# Altium project Controller-Board.PrjPcb
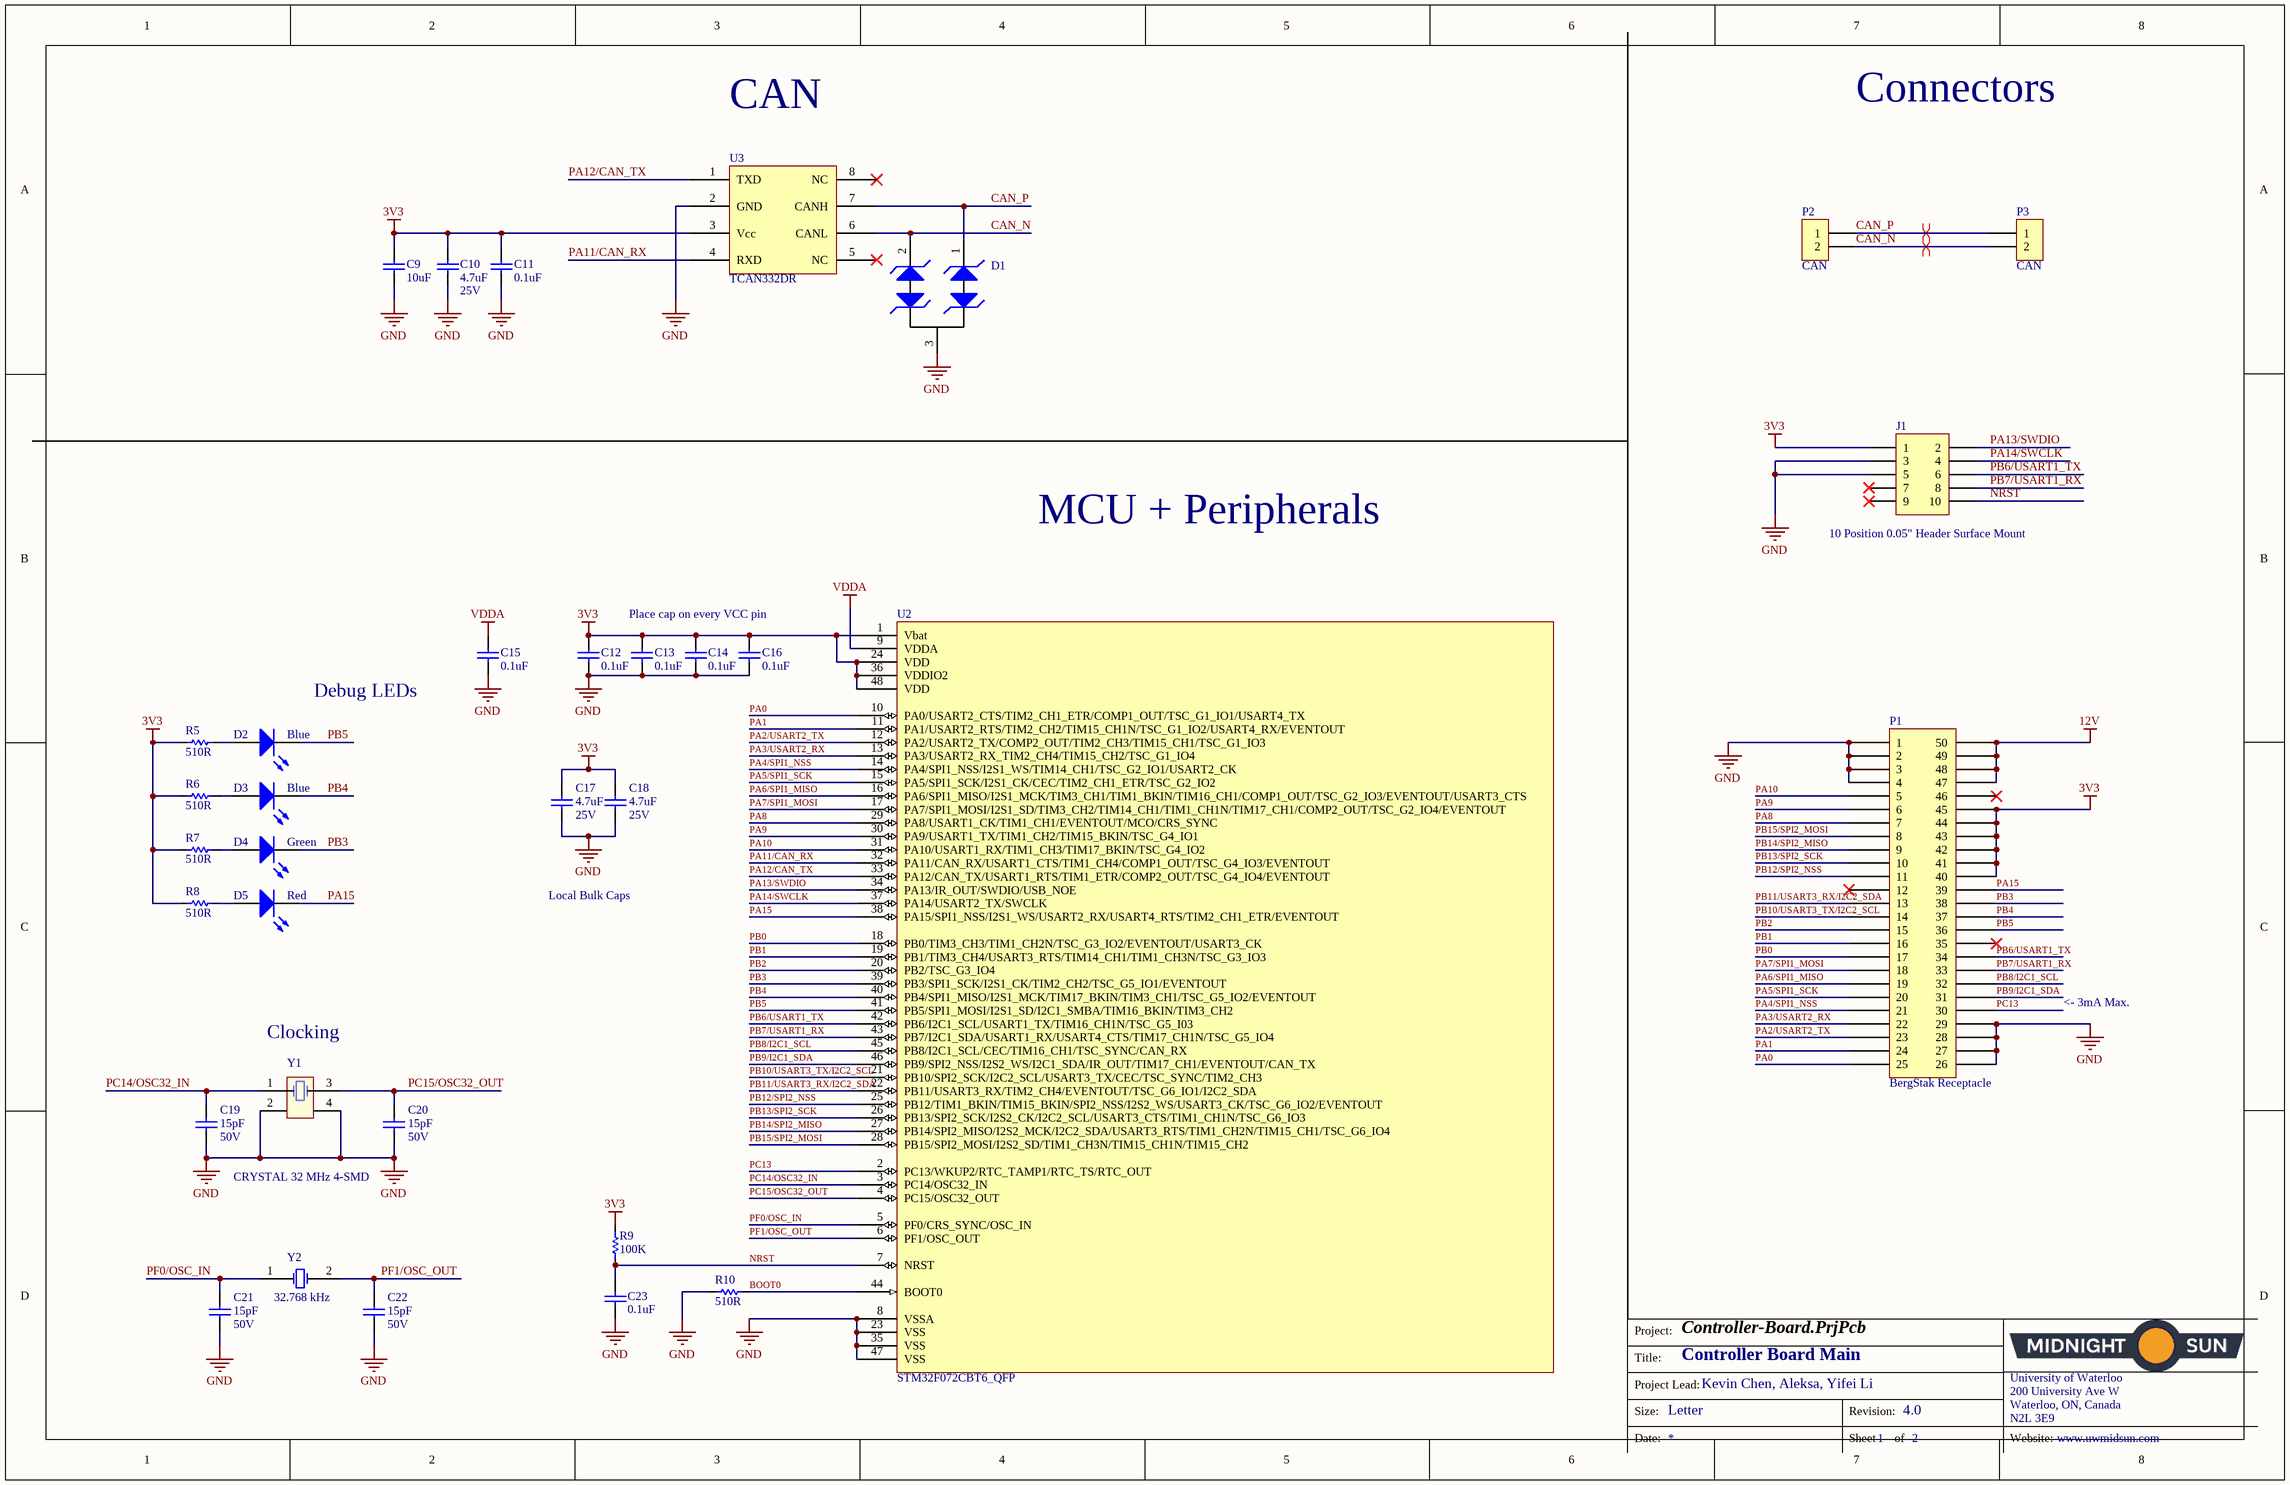
[diagram p0: Controller_Board_Main.SchDoc]
2 sheets, 56 parts. Net scope: global (net labels, ports and power ports of the same name join across sheets).
Board files: Controller-Board-Rev3.PcbDoc, Controller-Board-Rev3-Panelized.PcbDoc
Sheets:
  Controller_Board_Main.SchDoc
  Controller_Board_Power_Supply.SchDoc

## Sheet Controller_Board_Main.SchDoc: Controller Board Main
size Tabloid; Author: Kevin Chen, Aleksa, Yifei Li; DrawnBy: Kevin Chen, Yifei Li; Engineer: Kevin Chen, Yifei Li; Revision: 4.0; SheetNumber: 1; SheetTotal: 2; PageSetup: Record=PageOptions|CenterHorizontal=True|CenterVertical=True|PrintScale=0.64|XCorrection=1.00|YCorrection=1.00|PrintKind=1|BorderSize=5000000|LeftOffset=0|BottomOffset=0|Orientation=2|PaperLength=1000|PaperWidth=1000|Scale=100|PaperSource=7|PrintQuality=-3|MediaType=1|DitherType=10|PrintScaleMode=1|PaperKind=Letter|PaperIndex=1; Website: www.uwmidsun.com

### Parts
C9  10uF  [CAPC1608X06N]
C10  4.7uF  Voltage: 25V  [CAPC1608X06N]
C11  0.1uF  [CAPC1608X06N]
C12  0.1uF  [CAPC1608X06N]
C13  0.1uF  [CAPC1608X06N]
C14  0.1uF  [CAPC1608X06N]
C15  0.1uF  [CAP, 0603]
C16  0.1uF  [CAPC1608X06N]
C17  4.7uF  Voltage: 25V  [CAPC1608X06N]
C18  4.7uF  Voltage: 25V  [CAPC1608X06N]
C19  15pF  Voltage: 50V  [CAPC1608X06N]
C20  15pF  Voltage: 50V  [CAPC1608X06N]
C21  15pF  Voltage: 50V  [CAPC1608X06N]
C22  15pF  Voltage: 50V  [CAPC1608X06N]
C23  0.1uF  [CAPC1608X06N]
D1  TVS Diode  [SOT23]  (value not drawn)
D2  Blue  [DIOC1608X06N]
D3  Blue  [DIOC1608X06N]
D4  Green  [DIOC1608X06N]
D5  Red  [DIOC1608X06N]
J1  10 Position 0.05" Header Surface Mount  [10 POS 1.27MM RECT CONN]
P1  BergStak Receptacle  [Bergstak 50 Pos Receptacle]
P2  CAN  [2 POS Dura-Click]
P3  CAN  [2 POS Dura-Click]
R5  510R  [RESC1608X06N]
R6  510R  [RESC1608X06N]
R7  510R  [RESC1608X06N]
R8  510R  [RESC1608X06N]
R9  100K  [RESC1608X06N]
R10  510R  [RESC1608X06N]
U2  STM32F072CBT6_QFP  [TSQFP50P890X890X160-48M]
U3  Manufacturer Part Number: TCAN332DR  [TSOP65P280X145-8N]  (hidden comment: TCAN332DR CAN Transceiver_SOT)
Y1  CRYSTAL 32 MHz 4-SMD  [CX2520DB CRYSTAL]
Y2  32.768 kHz  [ABS07AIG CRYSTAL]

### Nets
3V3: C9.2 C10.2 C11.2 C12.2 C13.2 C14.2 C16.2 C17.2 C18.2 J1.1 P1.40 P1.41 P1.42 P1.43 P1.44 P1.45 R5.1 R6.1 R7.1 R8.1 R9.2 U2.1(Vbat) U2.24(VDD) U2.36(VDDIO2) U2.48(VDD) U3.3(Vcc)
12V: P1.47 P1.48 P1.49 P1.50
GND: C9.1 C10.1 C11.1 C12.1 C13.1 C14.1 C15.1 C16.1 C17.1 C18.1 C19.1 C20.1 C21.1 C22.1 C23.1 D1.3(Common_Cathode) J1.3 J1.5 P1.1 P1.2 P1.3 P1.4 P1.26 P1.27 P1.28 P1.29 R10.1 U2.8(VSSA) U2.23(VSS) U2.35(VSS) U2.47(VSS) U3.2(GND) Y1.2 Y1.4
VDDA: C15.2 U2.9(VDDA)
BOOT0: R10.2 U2.44(BOOT0)
CAN_N: D1.2(Cathode2) P2.2 P3.2 U3.6(CANL)
CAN_P: D1.1(Cathode1) P2.1 P3.1 U3.7(CANH)
NRST: C23.2 J1.10 R9.1 U2.7(NRST)
PA0: P1.25 U2.10(PA0/USART2_CTS/TIM2_CH1_ETR/COMP1_OUT/TSC_G1_IO1/USART4_TX)
PA1: P1.24 U2.11(PA1/USART2_RTS/TIM2_CH2/TIM15_CH1N/TSC_G1_IO2/USART4_RX/EVENTOUT)
PA2/USART2_TX: P1.23 U2.12(PA2/USART2_TX/COMP2_OUT/TIM2_CH3/TIM15_CH1/TSC_G1_IO3)
PA3/USART2_RX: P1.22 U2.13(PA3/USART2_RX_TIM2_CH4/TIM15_CH2/TSC_G1_IO4)
PA4/SPI1_NSS: P1.21 U2.14(PA4/SPI1_NSS/I2S1_WS/TIM14_CH1/TSC_G2_IO1/USART2_CK)
PA5/SPI1_SCK: P1.20 U2.15(PA5/SPI1_SCK/I2S1_CK/CEC/TIM2_CH1_ETR/TSC_G2_IO2)
PA6/SPI1_MISO: P1.19 U2.16(PA6/SPI1_MISO/I2S1_MCK/TIM3_CH1/TIM1_BKIN/TIM16_CH1/COMP1_OUT/TSC_G2_IO3/EVENTOUT/USART3_CTS)
PA7/SPI1_MOSI: P1.18 U2.17(PA7/SPI1_MOSI/I2S1_SD/TIM3_CH2/TIM14_CH1/TIM1_CH1N/TIM17_CH1/COMP2_OUT/TSC_G2_IO4/EVENTOUT)
PA8: P1.7 U2.29(PA8/USART1_CK/TIM1_CH1/EVENTOUT/MCO/CRS_SYNC)
PA9: P1.6 U2.30(PA9/USART1_TX/TIM1_CH2/TIM15_BKIN/TSC_G4_IO1)
PA10: P1.5 U2.31(PA10/USART1_RX/TIM1_CH3/TIM17_BKIN/TSC_G4_IO2)
PA11/CAN_RX: U2.32(PA11/CAN_RX/USART1_CTS/TIM1_CH4/COMP1_OUT/TSC_G4_IO3/EVENTOUT) U3.4(RXD)
PA12/CAN_TX: U2.33(PA12/CAN_TX/USART1_RTS/TIM1_ETR/COMP2_OUT/TSC_G4_IO4/EVENTOUT) U3.1(TXD)
PA13/SWDIO: J1.2 U2.34(PA13/IR_OUT/SWDIO/USB_NOE)
PA14/SWCLK: J1.4 U2.37(PA14/USART2_TX/SWCLK)
PA15: D5.2(K) P1.39 U2.38(PA15/SPI1_NSS/I2S1_WS/USART2_RX/USART4_RTS/TIM2_CH1_ETR/EVENTOUT)
PB0: P1.17 U2.18(PB0/TIM3_CH3/TIM1_CH2N/TSC_G3_IO2/EVENTOUT/USART3_CK)
PB1: P1.16 U2.19(PB1/TIM3_CH4/USART3_RTS/TIM14_CH1/TIM1_CH3N/TSC_G3_IO3)
PB2: P1.15 U2.20(PB2/TSC_G3_IO4)
PB3: D4.2(K) P1.38 U2.39(PB3/SPI1_SCK/I2S1_CK/TIM2_CH2/TSC_G5_IO1/EVENTOUT)
PB4: D3.2(K) P1.37 U2.40(PB4/SPI1_MISO/I2S1_MCK/TIM17_BKIN/TIM3_CH1/TSC_G5_IO2/EVENTOUT)
PB5: D2.2(K) P1.36 U2.41(PB5/SPI1_MOSI/I2S1_SD/I2C1_SMBA/TIM16_BKIN/TIM3_CH2)
PB6/USART1_TX: J1.6 P1.34 U2.42(PB6/I2C1_SCL/USART1_TX/TIM16_CH1N/TSC_G5_I03)
PB7/USART1_RX: J1.8 P1.33 U2.43(PB7/I2C1_SDA/USART1_RX/USART4_CTS/TIM17_CH1N/TSC_G5_IO4)
PB8/I2C1_SCL: P1.32 U2.45(PB8/I2C1_SCL/CEC/TIM16_CH1/TSC_SYNC/CAN_RX)
PB9/I2C1_SDA: P1.31 U2.46(PB9/SPI2_NSS/I2S2_WS/I2C1_SDA/IR_OUT/TIM17_CH1/EVENTOUT/CAN_TX)
PB10/USART3_TX/I2C2_SCL: P1.14 U2.21(PB10/SPI2_SCK/I2C2_SCL/USART3_TX/CEC/TSC_SYNC/TIM2_CH3)
PB11/USART3_RX/I2C2_SDA: P1.13 U2.22(PB11/USART3_RX/TIM2_CH4/EVENTOUT/TSC_G6_IO1/I2C2_SDA)
PB12/SPI2_NSS: P1.11 U2.25(PB12/TIM1_BKIN/TIM15_BKIN/SPI2_NSS/I2S2_WS/USART3_CK/TSC_G6_IO2/EVENTOUT)
PB13/SPI2_SCK: P1.10 U2.26(PB13/SPI2_SCK/I2S2_CK/I2C2_SCL/USART3_CTS/TIM1_CH1N/TSC_G6_IO3)
PB14/SPI2_MISO: P1.9 U2.27(PB14/SPI2_MISO/I2S2_MCK/I2C2_SDA/USART3_RTS/TIM1_CH2N/TIM15_CH1/TSC_G6_IO4)
PB15/SPI2_MOSI: P1.8 U2.28(PB15/SPI2_MOSI/I2S2_SD/TIM1_CH3N/TIM15_CH1N/TIM15_CH2)
PC13: P1.30 U2.2(PC13/WKUP2/RTC_TAMP1/RTC_TS/RTC_OUT)
PC14/OSC32_IN: C19.2 U2.3(PC14/OSC32_IN) Y1.1(OSC1)
PC15/OSC32_OUT: C20.2 U2.4(PC15/OSC32_OUT) Y1.3(OSC2)
PF0/OSC_IN: C21.2 U2.5(PF0/CRS_SYNC/OSC_IN) Y2.1
PF1/OSC_OUT: C22.2 U2.6(PF1/OSC_OUT) Y2.2
NetD2_1: D2.1(A) R5.2
NetD3_1: D3.1(A) R6.2
NetD4_1: D4.1(A) R7.2
NetD5_1: D5.1(A) R8.2

Not connected (* = marked no-connect by the designer): J1 7* 9*; P1 12* 35* 46*; U3 5(NC)* 8(NC)*

### Layout directives
differential pair: CAN_N, CAN_P

### Notes on the sheet
- CAN
- Connectors
- MCU + Peripherals
- Place cap on every VCC pin
- Debug LEDs
- Local Bulk Caps
- <- 3mA Max.
- (near Y1) Clocking
- Project:
- Title:
- Size:
- Project Lead:
- Letter
- Revision:
- University of Waterloo
- 200 University Ave W
- Waterloo, ON, Canada
- N2L 3E9
- Date:
- Sheet
- of
- Website:

### Library data of the parts
C9 = CAP CER 10uF 25V 20% X5R 0603: 10µF ±20% 25V Ceramic Capacitor X5R 0603 (1608 Metric); Manufacturer: Murata Electronics North America; ManufacturerPartNumber: GRM188R61E106MA73D; Value: 10uF; Supplier: Digi-Key; SupplierPartNumber: 490-7202-1-ND; Voltage: 25V
C10 C17 C18 = CAP CER 4.7UF 25V 10% X5R 0603: 4.7µF ±10% 25V Ceramic Capacitor X5R 0603 (1608 Metric); Manufacturer: Murata Electronics North America; ManufacturerPartNumber: GRM188R61E475KE11D; Value: 4.7uF; Supplier: Digi-Key; SupplierPartNumber: 490-7203-1-ND
C11-C16 C23 = CAP CER 0.1UF 50V 10% X7R 0603: 0.10µF ±10% 50V Ceramic Capacitor X7R 0603 (1608 Metric); Manufacturer: AVX Corporation; ManufacturerPartNumber: 06035C104KAT2A; Value: 0.1uF; Supplier: Digi-Key; SupplierPartNumber: 478-5052-1-ND; Voltage: 50V
C19-C22 = CAP CER 15PF 50V NPO 0603: 15pF ±5% 50V Ceramic Capacitor C0G, NP0 0603 (1608 Metric); Manufacturer: Yageo; ManufacturerPartNumber: CC0603JRNPO9BN150; Value: 15pF; Supplier: Digi-Key; SupplierPartNumber: 311-1060-1-ND
D1 = TVS Diode: TVS DIODE 24VWM 70VC SOT23; Reverse_Standoff_Voltage: 24V; Supplier: Digikey; Supplier_PN: 568-4032-1-ND
D2 D3 = LED_BLUE: LED BLUE CLEAR 0603 SMD; Manufacturer: Lite-On Inc.; Manufacturer Part Number: LTST-C193TBKT-5A; Forward Voltage: 2.8V; DC Foward Current: 20mA; Digikey Part Number: 160-1827-1-ND; Color: Blue
D4 = LED_GREEN: LED GREEN CLEAR 0603 SMD; Manufacturer: Lite-On Inc.; Manufacturer Part Number: LTST-C193KGKT-5A; Forward Voltage: 2.0V; DC Forward Current: 30mA; Package: 0603; Color: Green; Supplier: Digi-Key; Supplier Part Number: 160-1828-1-ND
D5 = LED_RED: Red LED 0603; Manufacture: Lite-On Inc.; Manufacture Part Number: LTST-C191KRKT; Forward Voltage: 2.0V; DC Forward Current: 30mA; Package: 0603; Color: Red; Supplier: Digi-Key; Supplier Part Number: 160-1447-1-ND
J1 = 10 Position 0.05" Header Surface Mount: 10 Positions Header Connector 0.050" (1.27mm) Surface Mount Gold; Manufacturer: Amphenol FCI; Manufacturer Part Number: 20021121-00010C4LF; Supplier: Digikey; SupplierPartNumber: 609-3695-1-ND
P1 = BergStak 50 Position Connector Receptacle: 50 Position Connector Receptacle, Center Strip Contacts Surface Mount Gold; Manufacturer Part Number: 10132798-052100LF; Digikey Part Number: 609-5227-1-ND; Supplier 1: Digi-Key; Supplier Part Number 1: 609-5227-1-ND
P2 P3 = 2 Position DuraClik CAN Connector: 2 Positions Header, Shrouded Connector 0.079" (2.00mm) Surface Mount, Right Angle Tin; Manufacturer: Molex; Manufacturer Part Number: 5023520200; Supplier: Digi-Key; Supplier Part Number: WM7169CT-ND
R5-R8 R10 = RES 510 OHM 1/10W 0603 SMD: RES SMD 510 OHM 5% 1/10W 0603; ManufacturerPartNumber: RC0603JR-07510RL; Manufacturer: Yageo; Value: 510R; Supplier: Digi-Key; SupplierPartNumber: 311-510GRCT-ND
R9 = RES 100K OHM 1/8W 5% 0603 SMD: RES SMD 100K OHM 5% 1/10W 0603; ManufacturerPartNumber: RC0603JR-07100KL; Manufacturer: Yageo; Value: 100K; Supplier: Digi-Key; SupplierPartNumber: 311-100KGRCT-ND
U3 = TCAN332DR CAN Transceiver_SOT: 1/1 Transceiver CAN 8-SOIC; Digikey Part Number: 296-43711-1-ND; Supplier 1: Digi-Key; Supplier Part Number 1: 296-43711-1-ND
Y1 = CRYSTAL 32 MHz 4-SMD: 32MHz ±15ppm Crystal 8pF 50 Ohm -40°C ~ 85°C AEC-Q200 Surface Mount 4-SMD, No Lead; Manufacturer PN: CX2520DB32000D0GPSC1; Manfacturer: AVX Corp/Kyocera Corp; Supplier: Digikey; Supplier PN: 1253-1730-1-ND
Y2 = CRYSTAL 32.768KHZ 9PF 2-SMD: 32.768kHz ±20ppm Crystal 6pF 50 kOhm -40°C ~ 85°C Surface Mount 4-SOJ, 5.50mm pitch; Manufacturer Part Number: ABS07AIG-32.768KHZ-9-1-T; Supplier: Digi-Key; Supplier Part Number: 535-13353-1-ND; VALUE: 32.768 kHz
U2 = STM32F072CBT6_QFP: Digikey Part Number: 497-14645-ND; Supplier: Digi-Key; Supplier Part Number: 497-14645-ND; Manufacturer Part Number: STM32F072CBT6

## Sheet Controller_Board_Power_Supply.SchDoc: Controller Board Power Supply
size Letter; Author: Kevin Chen, Aleksa, Yifei Li; DrawnBy: Kevin Chen, Yifei Li; Engineer: Kevin Chen, Yifei Li; Revision: 3.0; SheetNumber: 2; SheetTotal: 2; Website: www.uwmidsun.com
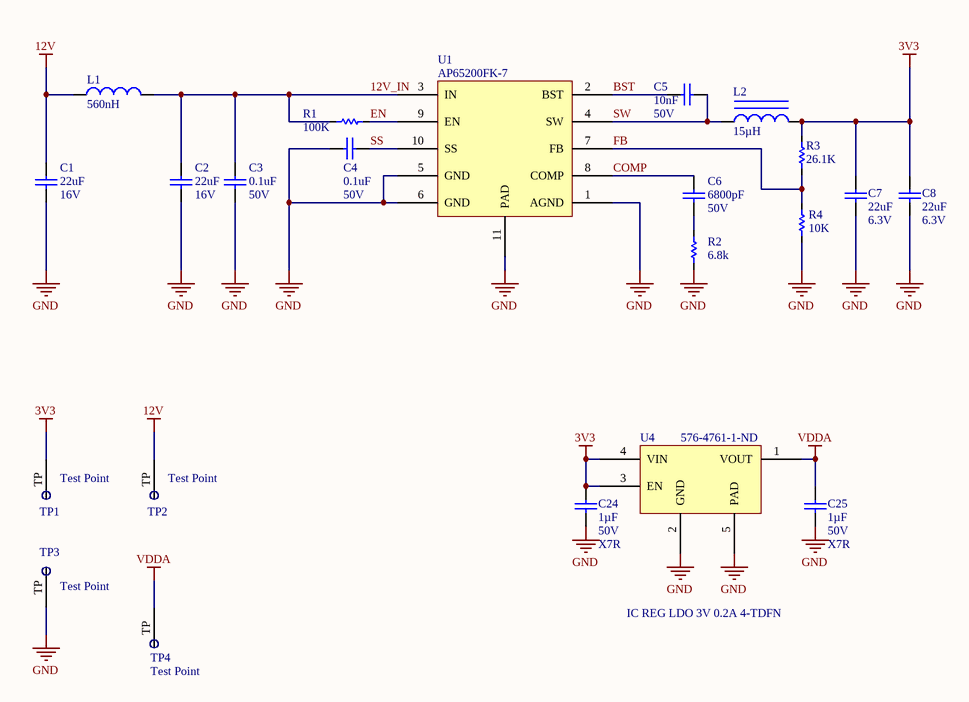
[diagram p1: Controller_Board_Power_Supply.SchDoc]

### Parts
C1  22uF  Voltage: 16V  [CAPC3225X28M]
C2  22uF  Voltage: 16V  [CAPC3225X28M]
C3  0.1uF  Voltage: 50V  [CAPC1608X06N]
C4  0.1uF  Voltage: 50V  [CAPC1608X06N]
C5  10nF  Voltage: 50V  [CAPC1608X06N]
C6  6800pF  Voltage: 50V  [CAPC1608X06N]
C7  22uF  Voltage: 6.3V  [CAPC3216X18N]
C8  22uF  Voltage: 6.3V  [CAPC3216X18N]
C24  Capacitance: 1µF  Voltage: 50V  Temperature Coefficient: X7R  [CAP, 0603]  (hidden comment: CAP CER 1UF 50V 10% X7R 0603)
C25  Capacitance: 1µF  Voltage: 50V  Temperature Coefficient: X7R  [CAP, 0603]  (hidden comment: CAP CER 1UF 50V 10% X7R 0603)
L1  560nH  [INDC2116X06N]
L2  15µH  [IND_BOURNS_SRR40]
R1  100K  [RESC1608X06N]
R2  6.8k  [RESC1608X06N]
R3  26.1K  [RESC1608X06N]
R4  10K  [RESC1608X06N]
TP1  Test Point  [Test Point]
TP2  Test Point  [Test Point]
TP3  Test Point  [Test Point]
TP4  Test Point  [Test Point]
U1  Manufacturer Part Number: AP65200FK-7  [10-UFDFN]  (hidden comment: AP65200FK-7 Buck Switching Regulator)
U4  IC REG LDO 3V 0.2A 4-TDFN  Supplier Part Number 1: 576-4761-1-ND  [IC REG LDO 3V 0.2A 4-TDFN]

### Nets
3V3: C7.2 C8.2 C24.1 L2.2 R3.2 TP1.TP U4.3(EN) U4.4(VIN)
12V: C1.2 L1.1 TP2.TP
GND: C1.1 C2.1 C3.1 C4.2 C7.1 C8.1 C24.2 C25.2 R2.1 R4.1 TP3.TP U1.1(AGND) U1.5(GND) U1.6(GND) U1.11(PAD) U4.2(GND) U4.5(PAD)
VDDA: C25.1 TP4.TP U4.1(VOUT)
12V_IN: C2.2 C3.2 L1.2 R1.1 U1.3(IN)
BST: C5.1 U1.2(BST)
COMP: C6.2 U1.8(COMP)
EN: R1.2 U1.9(EN)
FB: R3.1 R4.2 U1.7(FB)
SS: C4.1 U1.10(SS)
SW: C5.2 L2.1 U1.4(SW)
NetC6_1: C6.1 R2.2

### Notes on the sheet
- Project:
- Title:
- Size:
- Project Lead:
- Letter
- Revision:
- University of Waterloo
- 200 University Ave W
- Waterloo, ON, Canada
- N2L 3E9
- Date:
- Sheet
- of
- Website:

### Library data of the parts
C1 C2 = CAP CER 22UF 16V X5R 1210: 22µF ±20% 16V Ceramic Capacitor X5R 1210 (3225 Metric); Manufacturer: Murata; ManufacturerPartNumber: GRM32ER61C226ME20L; Value: 22uF; Supplier: Digi-Key; SupplierPartNumber: 490-1881-1-ND
C3 C4 = CAP CER 0.1UF 50V 10% X7R 0603: as C11 on sheet Controller_Board_Main; Value: 0.1uF; Supplier: Digi-Key; SupplierPartNumber: 478-5052-1-ND
C5 = CAP CER 10nF 50V 5% X7R 0603: 10000pF ±5% 50V Ceramic Capacitor U2J 0603 (1608 Metric); Manufacturer: Kemet; ManufacturerPartNumber: C0603C103J5JAC7867; Value: 10nF; Supplier: Digi-Key; SupplierPartNumber: 399-13384-1-ND
C6 = CAP CER 6800pF 50V 10% X7R 0603: 6800pF ±10% 50V Ceramic Capacitor X7R 0603 (1608 Metric); Manufacturer: Samsung Electro-Mechanics America, Inc.; ManufacturerPartNumber: CL10B682KB8SFNC; Value: 6800pF; Supplier: Digi-Key; SupplierPartNumber: 1276-2103-1-ND
C7 C8 = CAP CER 22UF 6.3V X7R 1206: 22µF ±10% 6.3V Ceramic Capacitor X7R 1206 (3216 Metric); Manufacturer: Murata; ManufacturerPartNumber: GRM31CR70J226KE19L; Value: 22uF; Supplier: Digi-Key; SupplierPartNumber: 490-6515-1-ND
C24 C25 = CAP CER 1UF 50V 10% X7R 0603: 1µF ±10% 50V Ceramic Capacitor X7R 0603 (1608 Metric); Manufacturer 1: Taiyo Yuden; Manufacturer Part Number 1: UMK107AB7105KA-T; Supplier 1: Digi-Key; Supplier Part Number 1: 587-3247-1-ND; Packaging: Cut Tape (CT); Part Status: Active; Operating Temperature: -55°C ~ 125°C; Ratings: -; Mounting Type: Surface Mount, MLCC; Package / Case: 0603 (1608 Metric); Size / Dimension: 0.063" L x 0.031" W (1.60mm x 0.80mm); Height - Seated (Max): -; Thickness (Max): 0.037" (0.95mm); Lead Spacing: -; Lead Style: -; ComponentLink1URL: http://www.yuden.co.jp/productdata/catalog/en/mlcc_all_e.pdf; ComponentLink1Description: http://www.yuden.co.jp/productdata/catalog/en/mlcc_all_e.pdf; Tolerance: ±10%
L1 = IND 560NH 2.1A 80 MOHM SMD: 560nH Shielded Multilayer Inductor 2.1A 80 mOhm Max 0806 (2016 Metric); Manufacturer: Wurth Electronics Inc.; Manufacturer Part Number: 74479977156; Supplier: Digi-Key; SupplierPartNumber: 445-15776-1-ND; Current Rating: 2.1A; DC Resistance (DCR): 80 mOhm Max; Value: 560nH
L2 = IND 15UH 1.03A 220 MOHM: 15µH Shielded Wirewound Inductor 1.03A 220 mOhm Max 1919 (4848 Metric); Manufacturer: Bourns Inc.; Manufacturer Part Number: SRR4018-150Y; Tolerance: ±30%; Current - Saturation: 820mA; Supplier 1: Digi-Key; Supplier Part Number 1: SRR4018-150YCT-ND; Type: Wirewound; Current Rating: 1.03A; DC Resistance (DCR): 220 mOhm Max; Height - Seated (Max): 0.079" (2.00mm); Inductance: 15µH
R1 = RES 100K OHM 1/8W 5% 0603 SMD: as R9 on sheet Controller_Board_Main; Value: 100K; Supplier: Digi-Key; SupplierPartNumber: 311-100KGRCT-ND
R2 = RES 6.8k OHM 1% 1/10W 0603 SMD: RES SMD 6.8K OHM 1% 1/10W 0603; ManufacturerPartNumber: RMCF0603FT6K80; Manufacturer: Stackpole Electronics Inc.; Value: 6.8k; Supplier: Digi-Key; Supplier Part Number: RMCF0603FT6K80CT-ND
R3 = RES 26.1K OHM 1/10W 1% 0603 SMD: RES SMD 26.1K OHM 1% 1/10W 0603; ManufacturerPartNumber: RC0603FR-0726K1L; Manufacturer: Yageo; Value: 26.1K; Supplier: Digi-Key; SupplierPartNumber: 311-26.1KHRCT-ND
R4 = RES SMD 10K OHM 1% 1/10W 0603: Manufacture: Yageo; Manufacture Part Number: RC0603FR-0710KL; Tolerance: 1%; Power: 1/10W; Package: 0603; Supplier: Digi-Key; Supplier Part Number: 311-10.0KHRTR-ND; Value: 10K
U1 = AP65200FK-7 Buck Switching Regulator: Buck Switching Reg IC Positive Adjustable 0.925V 1 Output 2A 10-UFDFN Exposed Pad; Digikey Part Number: AP65200FK-7DICT-ND; Supplier 1: Digi-Key; Supplier Part Number 1: AP65200FK-7DICT-ND
U4 = IC REG LDO 3V 0.2A 4-TDFN: Manufacturer: Microchip Technology; Manufacturer Part Number: MIC94310-PYMT-TR; Regulator Topology: Positive Fixed; Current - Output: 200mA; Voltage - Dropout (Typical): 0.04V @ 200mA; Voltage - Input: Up to 3.6V; Current - Limit (Min): 250mA; Supplier 1: Digi-Key; RoHS: RoHS Compliant; Category: Integrated Circuits (ICs); Stock 1: 4802; Pricing 1: 1=0.45, 25=0.3708, 100=0.3386 (CAD); Packaging: Cut Tape (CT); Part Status: Active; Voltage - Output: 3V; Operating Temperature: -40°C ~ 125°C; Mounting Type: Surface Mount; Package / Case: 4-UFDFN Exposed Pad; Supplier Device Package: 4-TDFN (1.2x1.6); ComponentLink1URL: http://www.microchip.com/mymicrochip/filehandler.aspx?ddocname=en580409; ComponentLink1Description: http://www.microchip.com/mymicrochip/filehandler.aspx?ddocname=en580409

## Nets that join several sheets
3V3: Controller_Board_Main (26 pins), Controller_Board_Power_Supply (8 pins)
12V: Controller_Board_Main (P1.47 P1.48 P1.49 P1.50), Controller_Board_Power_Supply (C1.2 L1.1 TP2.TP)
GND: Controller_Board_Main (34 pins), Controller_Board_Power_Supply (17 pins)
VDDA: Controller_Board_Main (C15.2 U2.9), Controller_Board_Power_Supply (C25.1 TP4.TP U4.1)